# Altium schematic sheet bb8_v2.SchDoc
size 660 x 381 mm; SheetNumber: 1; SheetTotal: 1
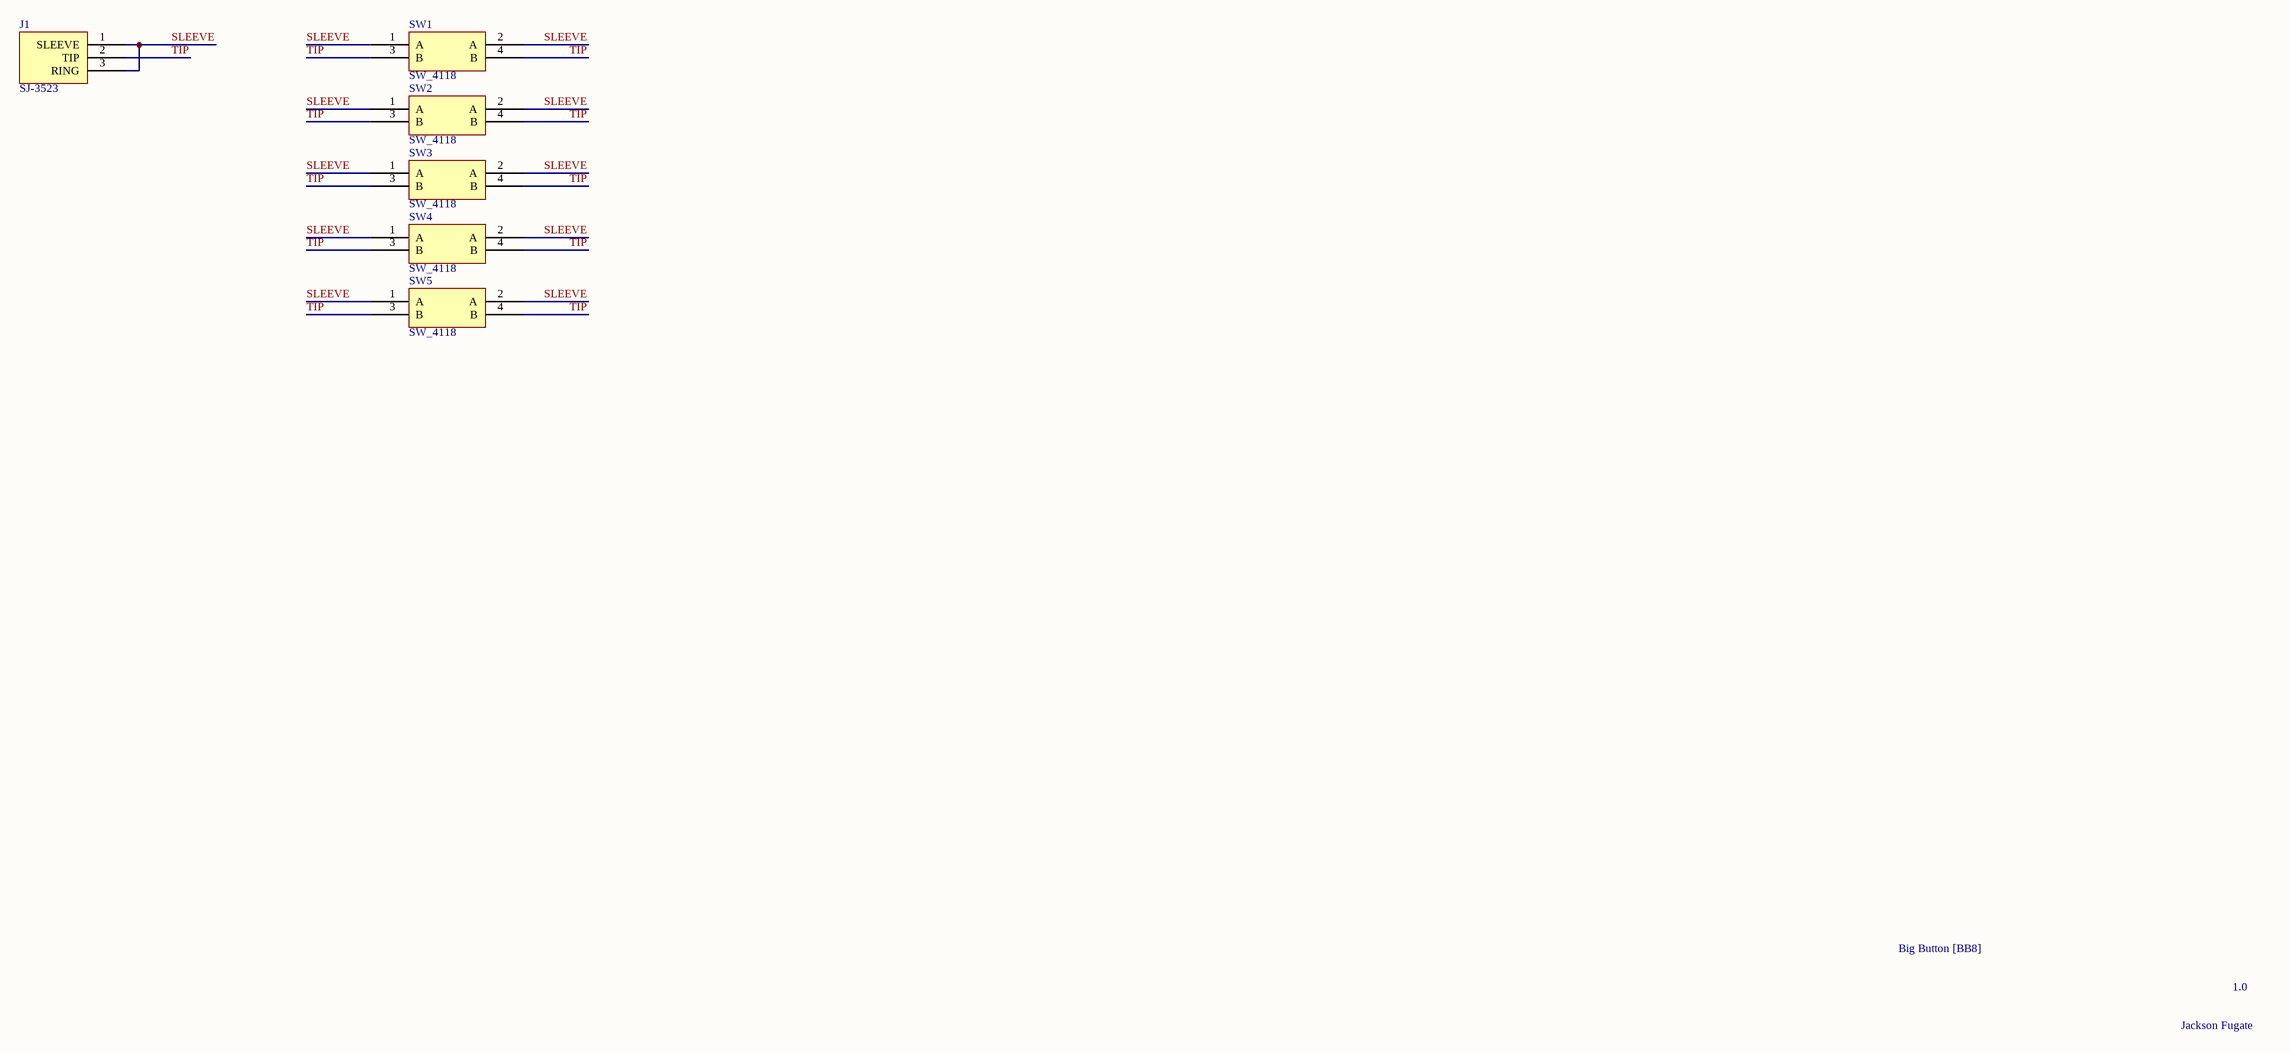
[diagram p0: bb8_v2.SchDoc]

## Parts
J1  SJ-3523  [SJ-352X]
SW1  SW_4118  [SW_4118]
SW2  SW_4118  [SW_4118]
SW3  SW_4118  [SW_4118]
SW4  SW_4118  [SW_4118]
SW5  SW_4118  [SW_4118]

## Nets
SLEEVE: J1.1(SLEEVE) J1.3(RING) SW1.1(A) SW1.2(A) SW2.1(A) SW2.2(A) SW3.1(A) SW3.2(A) SW4.1(A) SW4.2(A) SW5.1(A) SW5.2(A)
TIP: J1.2(TIP) SW1.3(B) SW1.4(B) SW2.3(B) SW2.4(B) SW3.3(B) SW3.4(B) SW4.3(B) SW4.4(B) SW5.3(B) SW5.4(B)

## Notes on the sheet
- Big Button [BB8]
- 1.0
- Jackson Fugate